# EAGLE schematic AutoCar (1) (EAGLE 9.5.0)
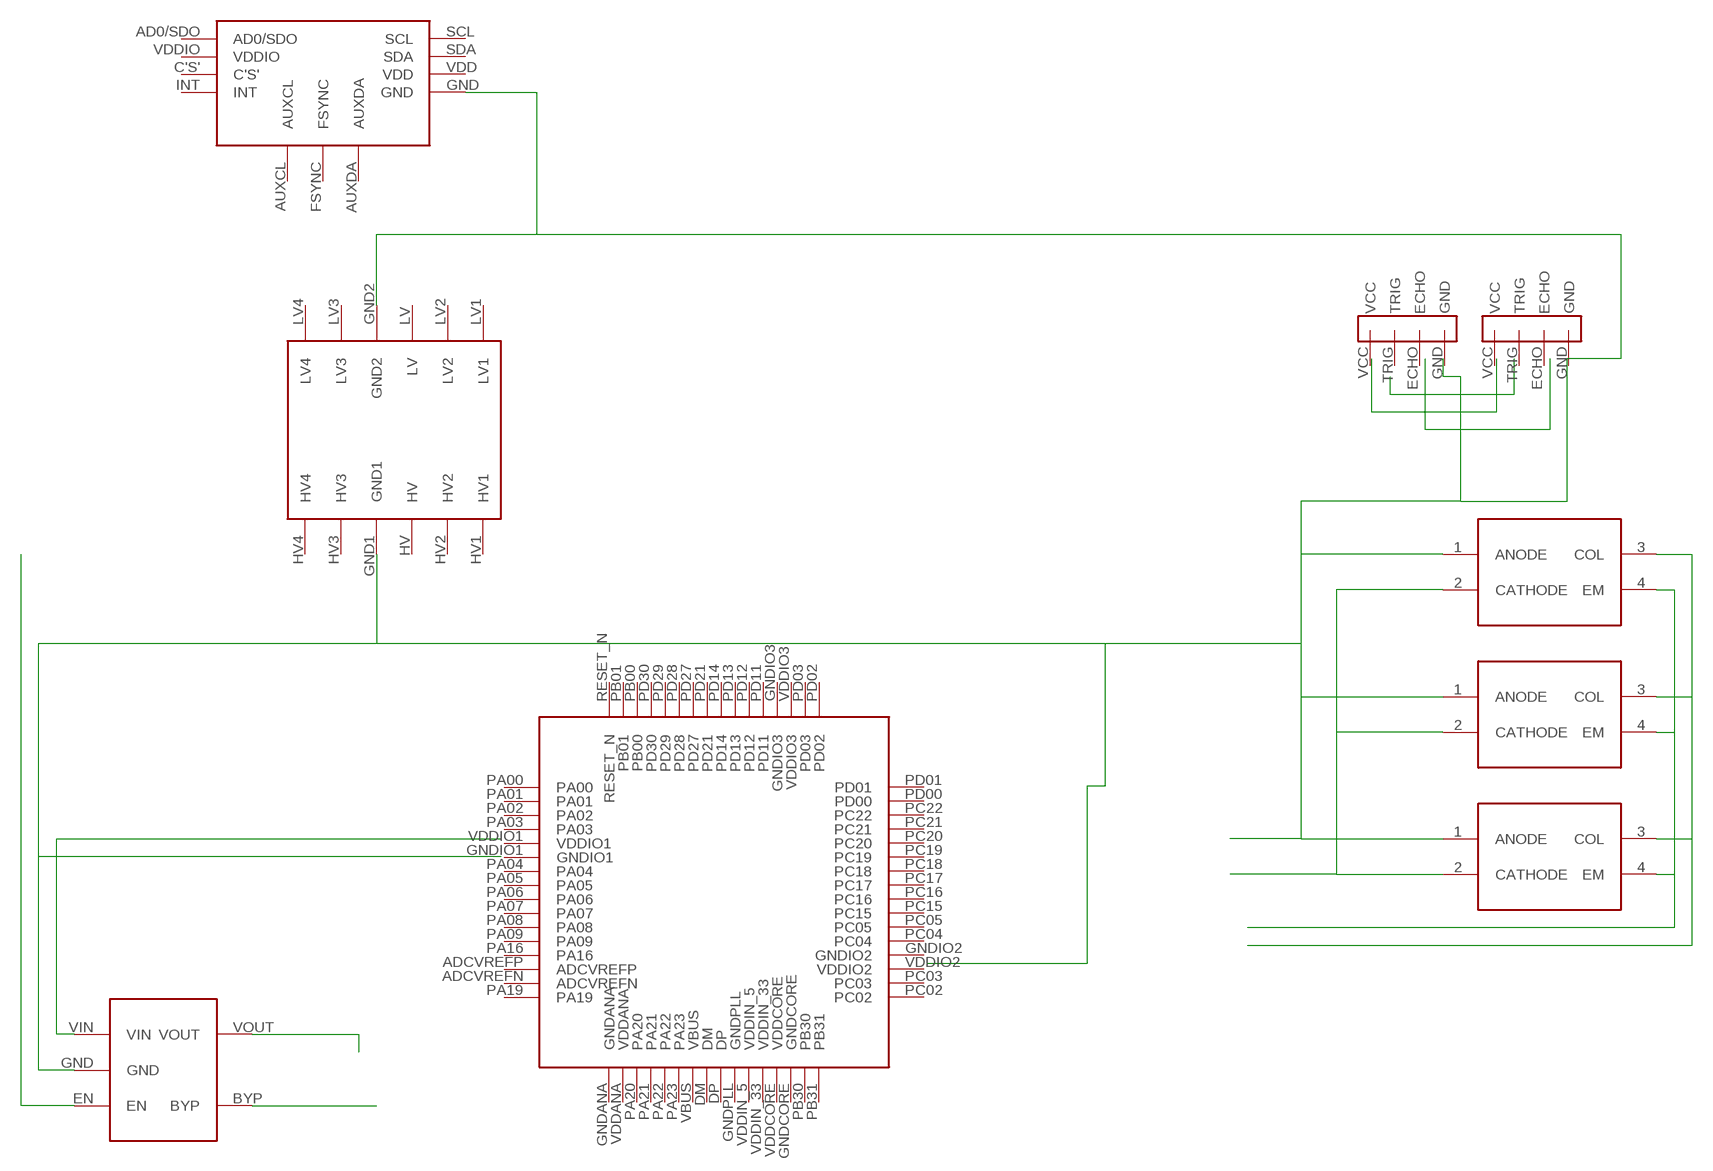
[diagram p0: schematic, sheet 1]

## Parts
U$1  AT32UC3C2512C-A2UT  [TQFP-64]
U$2  QRE1113GR  [4-SMD]
U$3  QRE1113GR  [4-SMD]
U$4  QRE1113GR  [4-SMD]
U$5  SEN-15569  [HC-SR04]
U$6  SEN-15569  [HC-SR04]
U$7  AP2210K-5.0TRG1  [SC-74A]
U$8  SEN-13762  [MPU-9250]
U$9  BOB-12009  [BSS138]

## Nets
N$2: U$2.2(CATHODE) U$3.2(CATHODE) U$4.2(CATHODE)
N$3: U$2.3(COL) U$3.3(COL) U$4.3(COL)
N$4: U$2.4(EM) U$3.4(EM) U$4.4(EM)
N$5: U$7.VOUT
N$6: U$7.BYP
N$7: U$7.EN
N$9: U$7.VIN
N$11: U$2.1(ANODE) U$3.1(ANODE) U$4.1(ANODE) U$7.GND U$8.GND U$9.GND1 U$9.GND2
Unconnected: U$1.ADCVREFN U$1.ADCVREFP U$1.DM U$1.DP U$1.GNDANA U$1.GNDCORE U$1.GNDIO1 U$1.GNDIO2 U$1.GNDIO3 U$1.GNDPLL U$1.PA00 U$1.PA01 U$1.PA02 U$1.PA03 U$1.PA04 U$1.PA05 U$1.PA06 U$1.PA07 U$1.PA08 U$1.PA09 U$1.PA16 U$1.PA19 U$1.PA20 U$1.PA21 U$1.PA22 U$1.PA23 U$1.PB00 U$1.PB01 U$1.PB30 U$1.PB31 U$1.PC02 U$1.PC03 U$1.PC04 U$1.PC05 U$1.PC15 U$1.PC16 U$1.PC17 U$1.PC18 U$1.PC19 U$1.PC20 U$1.PC21 U$1.PC22 U$1.PD00 U$1.PD01 U$1.PD02 U$1.PD03 U$1.PD11 U$1.PD12 U$1.PD13 U$1.PD14 U$1.PD21 U$1.PD27 U$1.PD28 U$1.PD29 U$1.PD30 U$1.RESET_N U$1.VBUS U$1.VDDANA U$1.VDDCORE U$1.VDDIN_5 U$1.VDDIN_33 U$1.VDDIO1 U$1.VDDIO2 U$1.VDDIO3 U$5.ECHO U$5.GND U$5.TRIG U$5.VCC U$6.ECHO U$6.GND U$6.TRIG U$6.VCC U$8.AD0/SDO U$8.AUXCL U$8.AUXDA U$8.C'S' U$8.FSYNC U$8.INT U$8.SCL U$8.SDA U$8.VDD U$8.VDDIO U$9.HV U$9.HV1 U$9.HV2 U$9.HV3 U$9.HV4 U$9.LV U$9.LV1 U$9.LV2 U$9.LV3 U$9.LV4

## Library data of the parts
U$1 = MILESTONE4LIB_E:AT32UC3C2512C-A2UT
U$2-U$4 = MILESTONE4LIB_E:QRE1113GR
U$5 U$6 = MILESTONE4LIB_E:SEN-15569
U$7 = MILESTONE4LIB_E:AP2210K-5.0TRG1
U$8 = miu:SEN-13762
U$9 = levelshifter:BOB-12009